# EAGLE design pinbox-r1 (EAGLE 5.12)
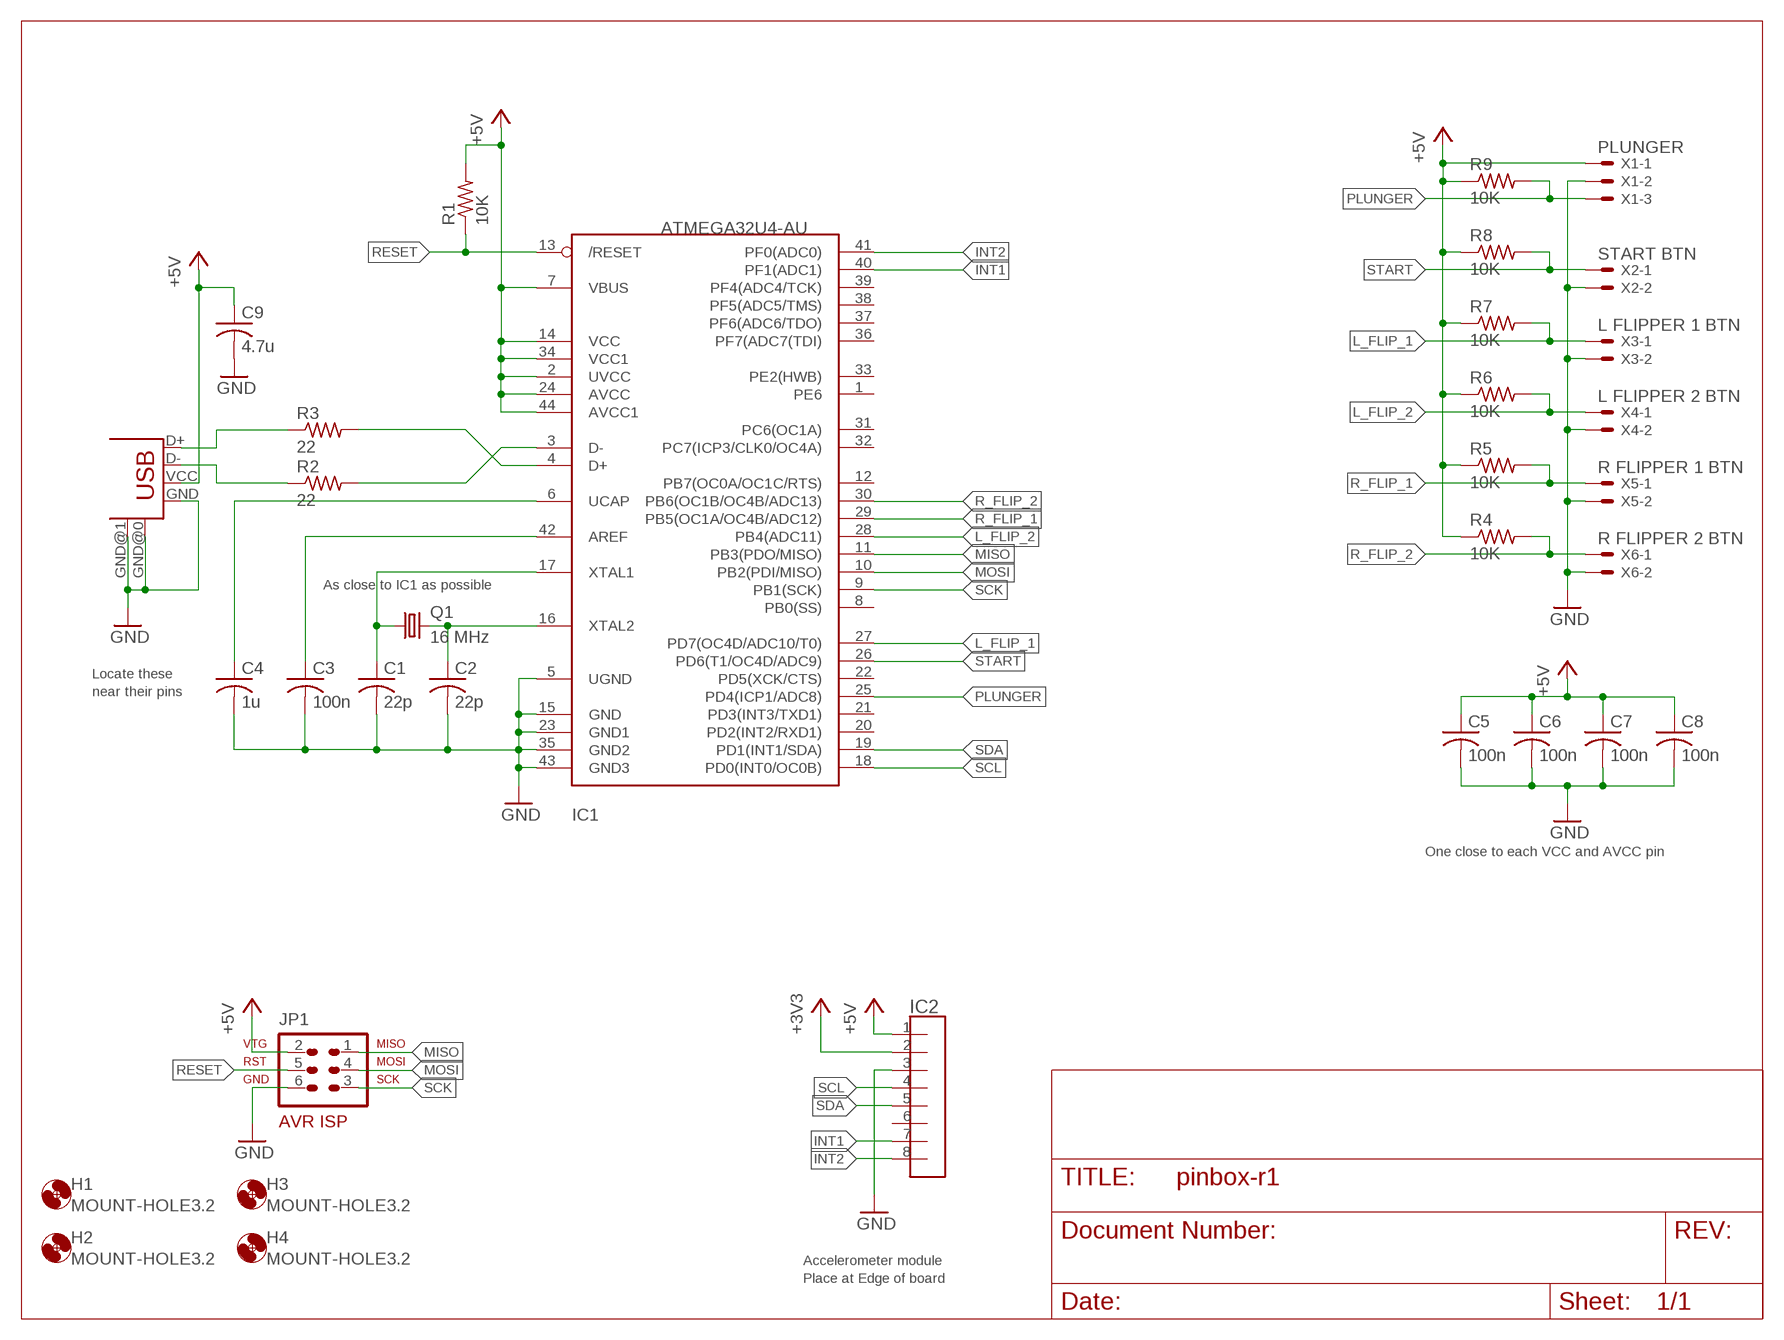
[diagram p0: schematic, sheet 1]

## Parts
C1  22p  C-USC0603  [C0603]
C2  22p  C-USC0603  [C0603]
C3  100n  C-USC0603  [C0603]
C4  1u  C-USC0603  [C0603]
C5  100n  C-USC0603  [C0603]
C6  100n  C-USC0603  [C0603]
C7  100n  C-USC0603  [C0603]
C8  100n  C-USC0603  [C0603]
C9  4.7u  C-USC0603  [C0603]
H1  MOUNT-HOLE3.2  [3,2]
H2  MOUNT-HOLE3.2  [3,2]
H3  MOUNT-HOLE3.2  [3,2]
H4  MOUNT-HOLE3.2  [3,2]
IC1  ATMEGA32U4-AU  [TQFP44]
IC2  M08-100MIL  [100MIL-8]
JP1  AVR-ISP-6  [AVR-ISP-6]
Q1  16 MHz  CRYSTALHC49UP  [HC49UP]
R1  10K  R-US_R0603  [R0603]
R2  22  R-US_R0603  [R0603]
R3  22  R-US_R0603  [R0603]
R4  10K  R-US_R0603  [R0603]
R5  10K  R-US_R0603  [R0603]
R6  10K  R-US_R0603  [R0603]
R7  10K  R-US_R0603  [R0603]
R8  10K  R-US_R0603  [R0603]
R9  10K  R-US_R0603  [R0603]
USB1  USB-U  [USB-MICROB-ALI]
X1  PLUNGER  22-23-2031  [22-23-2031]
X2  START BTN  22-23-2021  [22-23-2021]
X3  L FLIPPER 1 BTN  22-23-2021  [22-23-2021]
X4  L FLIPPER 2 BTN  22-23-2021  [22-23-2021]
X5  R FLIPPER 1 BTN  22-23-2021  [22-23-2021]
X6  R FLIPPER 2 BTN  22-23-2021  [22-23-2021]

## Nets
+3V3: IC2.2
+5V: C5.1 C6.1 C7.1 C8.1 C9.1 IC1.2(UVCC) IC1.7(VBUS) IC1.14(VCC) IC1.24(AVCC) IC1.34(VCC1) IC1.44(AVCC1) IC2.1 JP1.2 R1.2 R4.1 R5.1 R6.1 R7.1 R8.1 R9.1 USB1.VCC(VBUS) X1.1
GND: C1.2 C2.2 C3.2 C4.2 C5.2 C6.2 C7.2 C8.2 C9.2 IC1.5(UGND) IC1.15(GND) IC1.23(GND1) IC1.35(GND2) IC1.43(GND3) IC2.3 JP1.6 USB1.GND USB1.GND@0(GND) USB1.GND@1(GND) X1.2 X2.2 X3.2 X4.2 X5.2 X6.2
INT1: IC1.40(PF1(ADC1)) IC2.7
INT2: IC1.41(PF0(ADC0)) IC2.8
L_FLIP_1: IC1.27(PD7(OC4D/ADC10/T0)) R7.2 X3.1
L_FLIP_2: IC1.28(PB4(ADC11)) R6.2 X4.1
MISO: IC1.11(PB3(PDO/MISO)) JP1.1
MOSI: IC1.10(PB2(PDI/MISO)) JP1.4
N$2: C3.1 IC1.42(AREF)
N$3: IC1.4(D+) R3.2
N$4: IC1.3(D-) R2.2
N$5: C2.1 IC1.16(XTAL2) Q1.2
N$6: C1.1 IC1.17(XTAL1) Q1.1
N$7: C4.1 IC1.6(UCAP)
N$8: R3.1 USB1.D+
N$9: R2.1 USB1.D-
PLUNGER: IC1.25(PD4(ICP1/ADC8)) R9.2 X1.3
R_FLIP_1: IC1.29(PB5(OC1A/OC4B/ADC12)) R5.2 X5.1
R_FLIP_2: IC1.30(PB6(OC1B/OC4B/ADC13)) R4.2 X6.1
RESET: IC1.13(/RESET) JP1.5 R1.1
SCK: IC1.9(PB1(SCK)) JP1.3
SCL: IC1.18(PD0(INT0/OC0B)) IC2.4
SDA: IC1.19(PD1(INT1/SDA)) IC2.5
START: IC1.26(PD6(T1/OC4D/ADC9)) R8.2 X2.1
Unconnected: IC1.1(PE6) IC1.8(PB0(SS)) IC1.12(PB7(OC0A/OC1C/RTS)) IC1.20(PD2(INT2/RXD1)) IC1.21(PD3(INT3/TXD1)) IC1.22(PD5(XCK/CTS)) IC1.31(PC6(OC1A)) IC1.32(PC7(ICP3/CLK0/OC4A)) IC1.33(PE2(HWB)) IC1.36(PF7(ADC7(TDI)) IC1.37(PF6(ADC6/TDO)) IC1.38(PF5(ADC5/TMS)) IC1.39(PF4(ADC4/TCK)) IC2.6

## Notes on the sheet
- As close to IC1 as possible
- Locate these
- near their pins
- One close to each VCC and AVCC pin
- Accelerometer module
- Place at Edge of board

## Library data of the parts
C1-C9 = rcl:C-US: CAPACITOR, American symbol
H1-H4 = holes:MOUNT-HOLE: MOUNTING HOLE with drill center marker
IC1 = adafruit:ATMEGA32U4: http://www.ladyada.net/library/eagle
IC2 = rbg-generic-headers:M08-100MIL
JP1 = avr-5:AVR-ISP-6: AVR ISP-6 Serial Programming Header
Q1 = crystal:CRYSTAL: CRYSTAL; OC_FARNELL: unknown; OC_NEWARK: unknown
R1-R9 = rcl:R-US_: RESISTOR, American symbol
USB1 = con-usb-2:USB: USB Connectors
X1 = con-molex:22-23-2031: .100" (2.54mm) Center Header - 3 Pin; MF: MOLEX; MPN: 22-23-2031; OC_FARNELL: 1462950; OC_NEWARK: 30C0862
X2-X6 = con-molex:22-23-2021: .100" (2.54mm) Center Header - 2 Pin; MF: MOLEX; MPN: 22-23-2021; OC_FARNELL: 1462926; OC_NEWARK: 25C3832

## Board
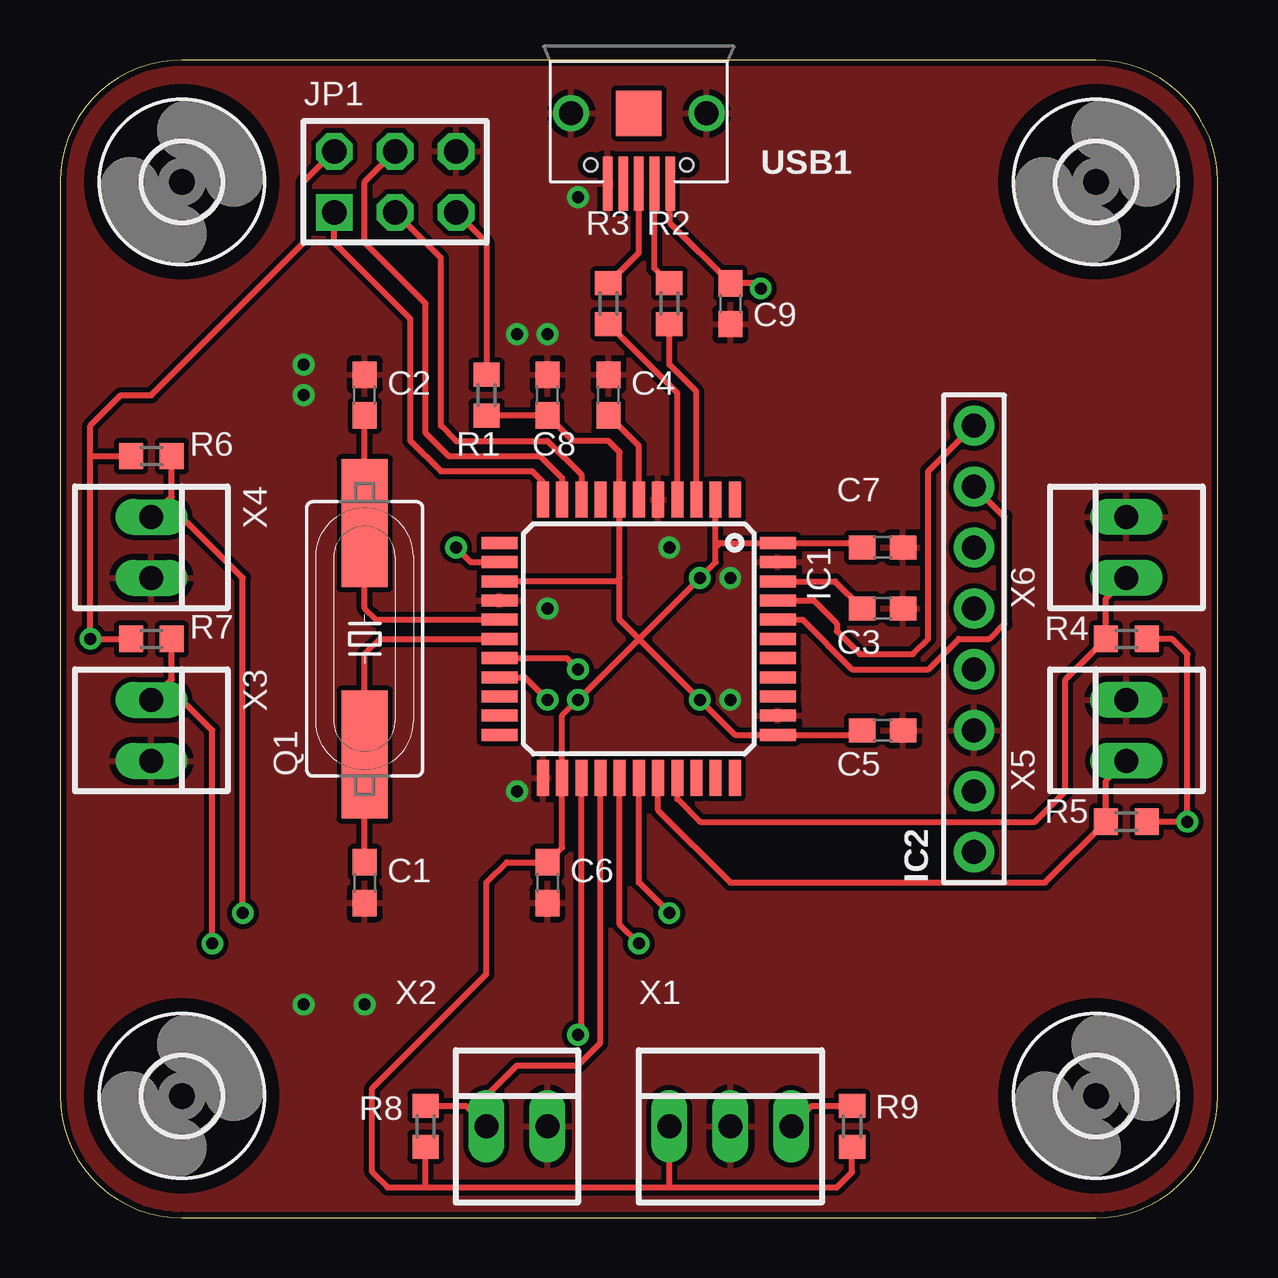
[diagram p1: board, top side]
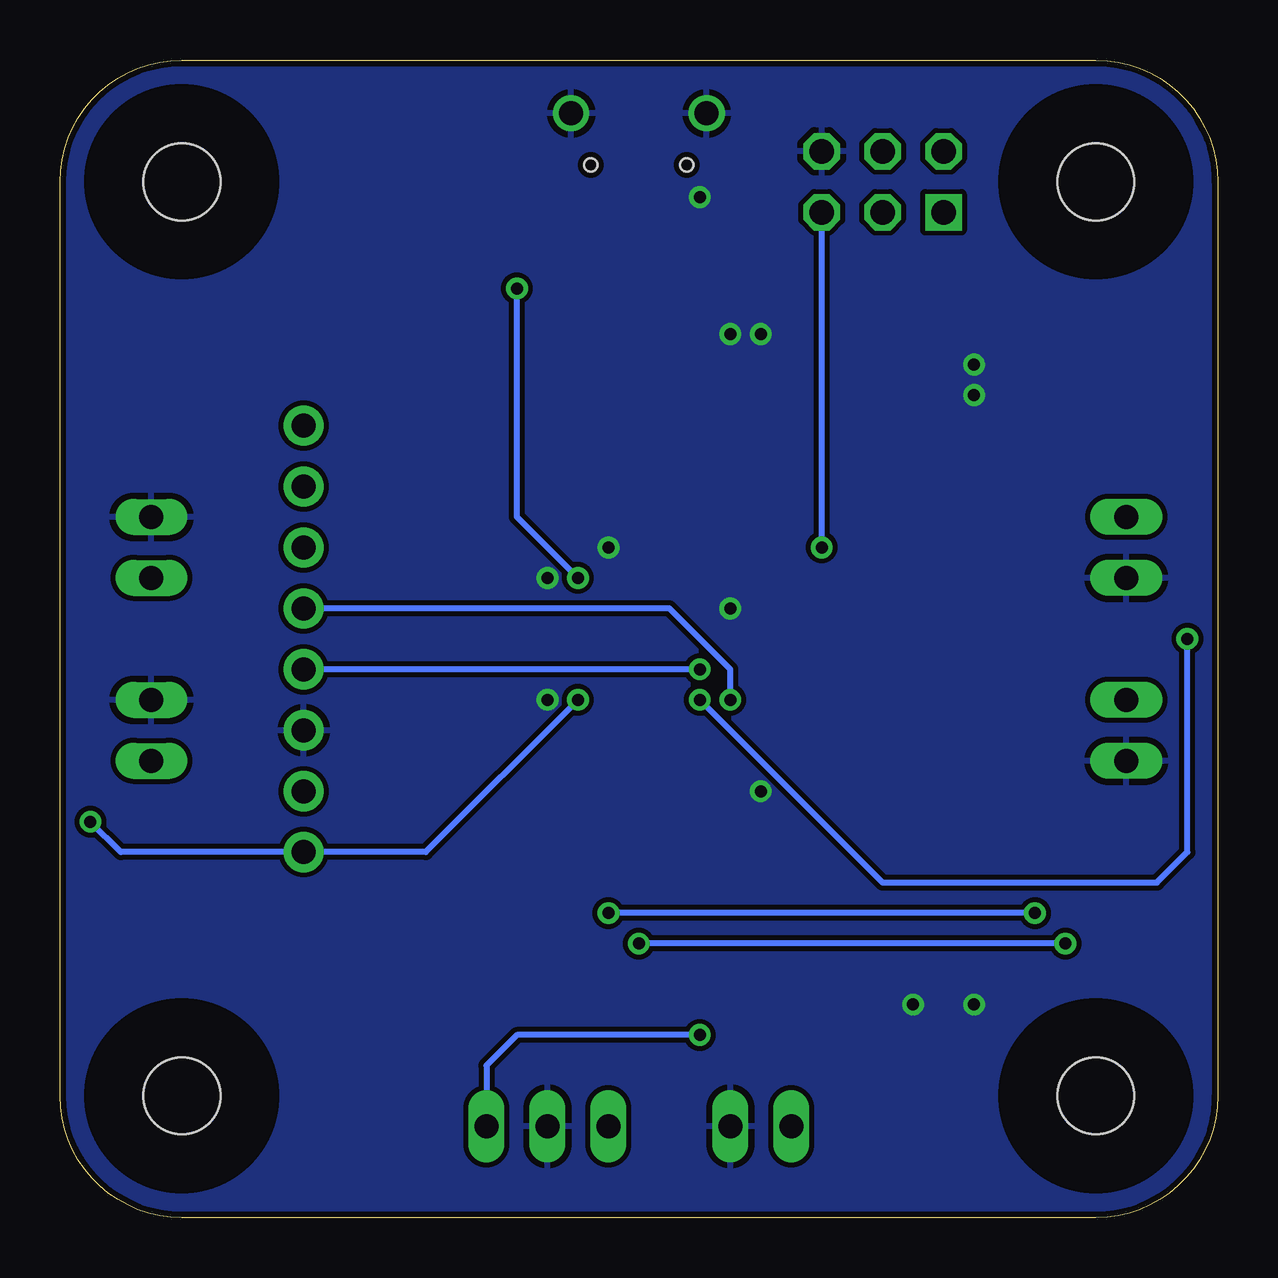
[diagram p2: board, bottom side, seen from below]

Size 48.26 x 48.26 mm. Coordinates in mm from the lower left corner, seen from the top.
Outline: 43.18,0 arc90 48.26,5.08 48.26,43.18 arc90 43.18,48.26 5.08,48.26 arc90 0,43.18 0,5.08 arc90 5.08,0 43.18,0
Copper layers (1*16): Top 0.035mm / dielectric 1.5mm / Bottom 0.035mm
Design rules "default *": minimum track width 10mil, minimum drill 0.5mm, track to track 8mil, track to pad 8mil, pad to pad 8mil, via to via 8mil, smd to smd 8mil, copper to edge 10mil, drill to drill 8mil, minimum pad ring 10mil, minimum via ring 8mil, stop-mask expansion 4mil, vias tented up to drill 0mil, thermal gap 10mil

### Footprints (pad centres in the part's own frame; a part is rotated, then mirrored left to right if it is on the bottom)
C0603 = smd 1.1 x 1: 1 -0.85,0; 2 0.85,0
3,2 = hole 3.2: 0,0
TQFP44 = smd 1.5 x 0.5: 1 -5.8,4; 2 -5.8,3.2; 3 -5.8,2.4; 4 -5.8,1.6; 5 -5.8,0.8; 6 -5.8,0; 7 -5.8,-0.8; 8 -5.8,-1.6; 9 -5.8,-2.4; 10 -5.8,-3.2; 11 -5.8,-4; 23 5.8,-4; 24 5.8,-3.2; 25 5.8,-2.4; 26 5.8,-1.6; 27 5.8,-0.8; 28 5.8,0; 29 5.8,0.8; 30 5.8,1.6; 31 5.8,2.4; 32 5.8,3.2; 33 5.8,4 | smd 0.5 x 1.5: 12 -4,-5.8; 13 -3.2,-5.8; 14 -2.4,-5.8; 15 -1.6,-5.8; 16 -0.8,-5.8; 17 0,-5.8; 18 0.8,-5.8; 19 1.6,-5.8; 20 2.4,-5.8; 21 3.2,-5.8; 22 4,-5.8; 34 4,5.8; 35 3.2,5.8; 36 2.4,5.8; 37 1.6,5.8; 38 0.8,5.8; 39 0,5.8; 40 -0.8,5.8; 41 -1.6,5.8; 42 -2.4,5.8; 43 -3.2,5.8; 44 -4,5.8
100MIL-8 = drill 1 pad 1.676 round: 1 -8.89,0; 2 -6.35,0; 3 -3.81,0; 4 -1.27,0; 5 1.27,0; 6 3.81,0; 7 6.35,0; 8 8.89,0
AVR-ISP-6 = drill 1.016 square: 1 -2.54,-1.27 | drill 1.016 octagon: 2 -2.54,1.27; 3 0,-1.27; 4 0,1.27; 5 2.54,-1.27; 6 2.54,1.27
HC49UP = smd 5.334 x 1.93: 1 -4.826,0; 2 4.826,0
R0603 = smd 1 x 1.1: 1 -0.85,0; 2 0.85,0
USB-MICROB-ALI = smd 0.4 x 2.25: D+ 0,2.925; D- -0.65,2.925; GND 1.3,2.925; ID 0.65,2.925; VCC -1.3,2.925 | drill 1 round: GND@0 -2.825,0; GND@1 2.825,0 | smd 1.9 x 1.9: GND@2 0,0 | hole 0.55: -2,2.15; 2,2.15
22-23-2031 = drill 1 long: 1 -2.54,0; 2 0,0; 3 2.54,0
22-23-2021 = drill 1 long: 1 -1.27,0; 2 1.27,0

### Placement (x,y rotation side)
C1  12.7,13.97 270 top
C2  12.7,34.29 90 top
C3  34.29,25.4 0 top
C4  22.86,34.29 90 top
C5  34.29,20.32 0 top
C6  20.32,13.97 270 top
C7  34.29,27.94 0 top
C8  20.32,34.29 90 top
C9  27.94,38.1 270 top
H1  43.18,43.18 0 top
H2  5.08,5.08 0 top
H3  43.18,5.08 0 top
H4  5.08,43.18 0 top
IC1  24.13,24.13 270 top
IC2  38.1,24.13 90 top
JP1  13.97,43.18 0 top
Q1  12.7,24.13 90 top
R1  17.78,34.29 270 top
R2  25.4,38.1 270 top
R3  22.86,38.1 270 top
R4  44.45,24.13 180 top
R5  44.45,16.51 180 top
R6  3.81,31.75 0 top
R7  3.81,24.13 0 top
R8  15.24,3.81 90 top
R9  33.02,3.81 90 top
USB1  24.13,46.04 180 top
X1  27.94,3.81 0 top
X2  19.05,3.81 0 top
X3  3.81,20.32 270 top
X4  3.81,27.94 270 top
X5  44.45,20.32 90 top
X6  44.45,27.94 90 top

### Tracks (layer width: path | path; a pad name or v marks a point on that pad's centre or on a via)
+5V  (via drill 0.5)
  Top 0.254: 23.33,26.67 23.33,24.93 24.13,24.13 | 23.33,26.67 IC1.7 23.33,31.91 22.86,32.38 21.38,32.38 C8.1 | 24.13,24.13 v26.67,21.59 28.13,20.13 IC1.34 33.25,20.13 C5.1 | IC1.14 23.19,26.53 23.33,26.67 | 24.13,24.13 v21.59,21.59 20.93,20.93 IC1.24 20.93,15.43 C6.1 18.63,14.82 17.78,13.97 17.78,10.16 13.02,5.4 13.02,1.91 13.65,1.27 15.24,1.27 | 27.33,27.94 27.33,27.33 v26.67,26.67 24.13,24.13 | 27.33,27.94 IC1.2 | 27.33,27.94 27.52,28.13 IC1.44 33.25,28.13 C7.1 | C8.1 20.32,33.02 | R4.1 46.35,24.13 46.99,23.5 v46.99,16.51 R5.1 | C8.1 R1.2 | USB1.VCC 25.43,41.46 C9.1 29,38.95 v29.21,38.73 | R7.1 v1.27,24.13 1.27,31.75 | JP1.2 10.16,43.18 10.16,40.64 3.81,34.29 2.54,34.29 1.27,33.02 1.27,31.75 | 1.27,31.75 R6.1 | 25.4,1.27 X1.1 | R9.1 33.02,1.91 32.38,1.27 25.4,1.27 | 15.24,1.27 25.4,1.27 | 15.24,1.27 R8.1
  Bottom 0.254: v26.67,21.59 33.02,15.24 IC2.1 45.72,15.24 v46.99,16.51 | v29.21,38.73 29.21,29.21 v26.67,26.67 | v1.27,24.13 1.27,15.24 2.54,13.97 13.97,13.97 v21.59,21.59
GND  (via drill 0.5)
  other vias: 21.59,42.55 19.05,36.83 20.32,36.83 25.4,27.94 27.94,26.67 20.32,25.4 19.05,17.78 27.94,21.59 10.16,8.89 12.7,8.89 10.16,34.29 10.16,35.56
  pour Top: 0,49.53 49.53,49.53 49.53,-1.27 -1.27,-1.27 -1.27,49.53
  pour Bottom: 0,49.53 49.53,49.53 49.53,-1.27 -1.27,-1.27 -1.27,49.53
INT1
  Top 0.254: IC1.40 30.95,24.93 33.02,22.86 36.2,22.86 37.47,24.13 38.73,24.13 39.37,24.77 39.37,29.21 IC2.7
INT2
  Top 0.254: IC1.41 31.42,25.73 32.38,24.77 32.38,24.45 33.34,23.5 35.56,23.5 36.2,24.13 36.2,31.11 IC2.8
L_FLIP_1  (via drill 0.5)
  Top 0.254: R7.2 4.66,22.44 X3.1 5.08,21.59 6.35,20.32 v6.35,11.43 | IC1.27 23.33,12.23 v24.13,11.43
  Bottom 0.254: v6.35,11.43 v24.13,11.43
L_FLIP_2  (via drill 0.5)
  Top 0.254: R6.2 4.66,30.06 X4.1 5.08,29.21 7.62,26.67 v7.62,12.7 | IC1.28 24.13,13.97 v25.4,12.7
  Bottom 0.254: v7.62,12.7 v25.4,12.7
MISO
  Top 0.254: IC1.11 20.13,30.67 19.68,31.11 15.88,31.11 14.61,32.38 14.61,37.47 11.43,40.64 JP1.1
MOSI
  Top 0.254: IC1.10 20.93,30.82 20,31.75 16.19,31.75 15.24,32.7 15.24,38.1 12.7,40.64 12.7,43.18 JP1.4
N$2
  Top 0.254: IC1.42 32.31,26.53 C3.1
N$3
  Top 0.254: IC1.4 25.73,34.38 R3.2
N$4
  Top 0.254: IC1.3 26.53,34.43 25.4,35.56 R2.2
N$5
  Top 0.254: IC1.16 13.17,24.93 12.7,25.4 Q1.2 C2.1
N$6
  Top 0.254: IC1.17 13.34,24.13 12.7,23.5 Q1.1 | Q1.1 12.7,19.05 | C1.1 Q1.1
N$7
  Top 0.254: IC1.6 24.13,32.17 C4.1
N$8
  Top 0.254: USB1.D+ 24.13,40.22 R3.1
N$9
  Top 0.254: USB1.D- 24.78,39.57 R2.1
PLUNGER  (via drill 0.5)
  Top 0.254: R9.2 31.33,4.66 X1.3 | IC1.25 21.73,7.76 v21.59,7.62
  Bottom 0.254: v21.59,7.62 29.21,7.62 30.48,6.35 X1.3
R_FLIP_1
  Top 0.254: IC1.29 24.93,16.98 27.94,13.97 41.06,13.97 R5.2 43.6,18.2 X5.1
R_FLIP_2
  Top 0.254: IC1.30 25.73,17.45 26.67,16.51 40.64,16.51 41.91,17.78 41.91,22.44 R4.2 43.6,25.82 X6.1
RESET  (via drill 0.5)
  Top 0.254: R1.1 17.78,40.64 JP1.5 | IC1.13 17.12,27.33 v16.51,27.94
  Bottom 0.254: v16.51,27.94 JP1.5
SCK
  Top 0.254: IC1.9 21.73,30.98 20.32,32.38 16.51,32.38 15.88,33.02 15.88,40.01 JP1.3
SCL  (via drill 0.5)
  Top 0.254: IC1.18 21.12,23.33 v21.59,22.86
  Bottom 0.254: v21.59,22.86 IC2.4
SDA  (via drill 0.5)
  Top 0.254: IC1.19 19.38,22.53 v20.32,21.59
  Bottom 0.254: v20.32,21.59 20.32,22.86 22.86,25.4 IC2.5
START
  Top 0.254: R8.2 16.93,4.66 X2.1 17.78,5.08 19.05,6.35 21.59,6.35 22.53,7.29 IC1.26